# Altium schematic sheet 04 - Storage.SchDoc
size A4
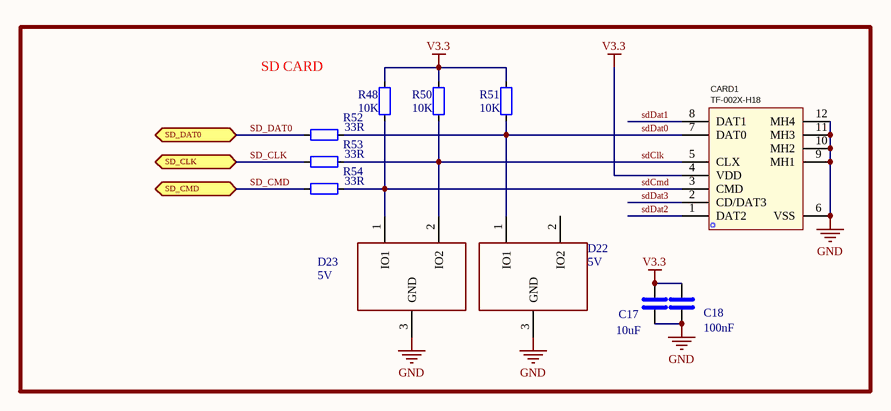
[diagram p0: 04 - Storage.SchDoc]

## Parts
C17  10uF  [CAP_0805]
C18  100nF  [CAP_0603]
CARD1  TF-002X-H18  [SIM-SMD_TF-002-H18]
D22  value 5V  [TPD2E2U06DCKR]  (hidden comment: Q100 TO CATALOG SPIN OF TPD2E2U0)
D23  value 5V  [TPD2E2U06DCKR]  (hidden comment: Q100 TO CATALOG SPIN OF TPD2E2U0)
R48  value 10K  [RES_0603]  (hidden comment: 10K 1%)
R50  value 10K  [RES_0603]  (hidden comment: 10K 1%)
R51  value 10K  [RES_0603]  (hidden comment: 10K 1%)
R52  33R  [RES_0603]
R53  33R  [RES_0603]
R54  33R  [RES_0603]

## Blocks framed on the sheet
SD CARD: C17 C18 CARD1 D22 D23 R48 R50-R54

## Ports
SD_CLK (bidir), SD_CMD (bidir), SD_DAT0 (bidir)

## Nets
GND: C17.2 C18.2 CARD1.6(VSS) CARD1.9(MH1) CARD1.10(MH2) CARD1.11(MH3) CARD1.12(MH4) D22.3(GND) D23.3(GND)
V3.3: C17.1 C18.1 CARD1.4(VDD) R48.1 R50.1 R51.1
SD_CLK: R53.1 ; port SD_CLK
SD_CMD: R54.1 ; port SD_CMD
SD_DAT0: R52.1 ; port SD_DAT0
sdClk: CARD1.5(CLX) D23.2(IO2) R50.2 R53.2
sdCmd: CARD1.3(CMD) D23.1(IO1) R48.2 R54.2
sdDat0: CARD1.7(DAT0) D22.1(IO1) R51.2 R52.2
sdDat1: CARD1.8(DAT1)
sdDat2: CARD1.1(DAT2)
sdDat3: CARD1.2(CD/DAT3)

Not connected (* = marked no-connect by the designer): D22 2(IO2)

## Notes on the sheet
- Title
- Size:
- Date:
- A4
- Number:
- Time:
- Revision:
- Sheet
- of
- File:

## Library data of the parts
C17 C18 = C
  C17: Value: 10uF; lcsc link: https://www.lcsc.com/product-detail/Multilayer-Ceramic-Capacitors-MLCC-SMD-SMT_Samsung-Electro-Mechanics-CL21A106KOQNNNE_C1713.html?s_z=n_C1713; LCSC PART: C1713; JLCPCB: C1713
  C18: pdf: https://www.lcsc.com/datasheet/lcsc_datasheet_2501031500_HRE-CGA0603X7R104K500JT_C6119867.pdf; LCSC PART: C6119867; lcsc link: https://www.lcsc.com/product-detail/Multilayer-Ceramic-Capacitors-MLCC-SMD-SMT_HRE-CGA0603X7R104K500JT_C6119867.html?s_z=n_100nF; JLCPCB: C6119867; Value: 100nF
CARD1 = TF-002X-H18: Card Slot MicroSD card (TF card) Flip type SMD SD Card / Memory Card Connector ROHS; Manufacturer: SOFNG(硕方); Symbol: TF-002-H18; Add into BOM: yes; Device: TF-002X-H18; LCSC Part Name: 翻盖式 MicroSD卡(TF卡) 卡座; Supplier Part: C125814; Manufacturer Part: TF-002X-H18; Supplier Footprint: SMD; JLCPCB Part Class: Extended Part; Datasheet: https://atta.szlcsc.com/upload/public/pdf/source/20200313/C125814_E45762AFA89F96AEF2D8FC2220BDEE92.pdf; Supplier: LCSC; Convert to PCB: yes; Card Connection Mode: Flip type; Card Type: MicroSD card (TF card); Connector Type: Card Slot; Maximum Body Height: -; Operating Temperature Range: -; pdf: https://www.lcsc.com/datasheet/lcsc_datasheet_2410121543_SOFNG-TF-002X-H18_C125814.pdf; lcsc link: https://www.lcsc.com/product-detail/SD-Card-Memory-Card-Connector_SOFNG-TF-002X-H18_C125814.html?s_z=n_microsd; LCSC PART: C125814; Value: TF-002X-H18; JLCPCB: C125814; JLCPCB: C458218
D22 D23 = Q100 TO CATALOG SPIN OF TPD2E2U0: TYPE: SMD; STOK KOD: HM0072; MFN: TPD2E2U06DCKR; NAME: Q100 TO CATALOG SPIN OF TPD2E2U0; JLCPCB: C5310938; LCSC PART: C5310938; lcsc link: https://www.lcsc.com/product-detail/ESD-and-Surge-Protection-TVS-ESD_TECH-PUBLIC-TPD2E2U06QDCKR-TP_C5310938.html?s_z=n_TPD2E2U0; pdf: https://www.lcsc.com/datasheet/lcsc_datasheet_2411121117_TECH-PUBLIC-TPD2E2U06QDCKR-TP_C5310938.pdf
R48 R50 R51 = R: JLCPCB: C25804; LCSC PART: C25804; lcsc link: https://www.lcsc.com/product-detail/Chip-Resistor-Surface-Mount_UNI-ROYAL-Uniroyal-Elec-0603WAF1002T5E_C25804.html
R52-R54 = R: 100mW Thick Film Resistors 75V ±100ppm/℃ ±1% 33Ω 0603 Chip Resistor - Surface Mount ROHS; Value: 33R; LCSC PART: C23140; JLCPCB: C23140; lcsc link: https://www.lcsc.com/product-detail/Chip-Resistor-Surface-Mount_UNI-ROYAL-Uniroyal-Elec-0603WAF330JT5E_C23140.html